# EAGLE design dbw.canbus.avr (EAGLE 5.07)
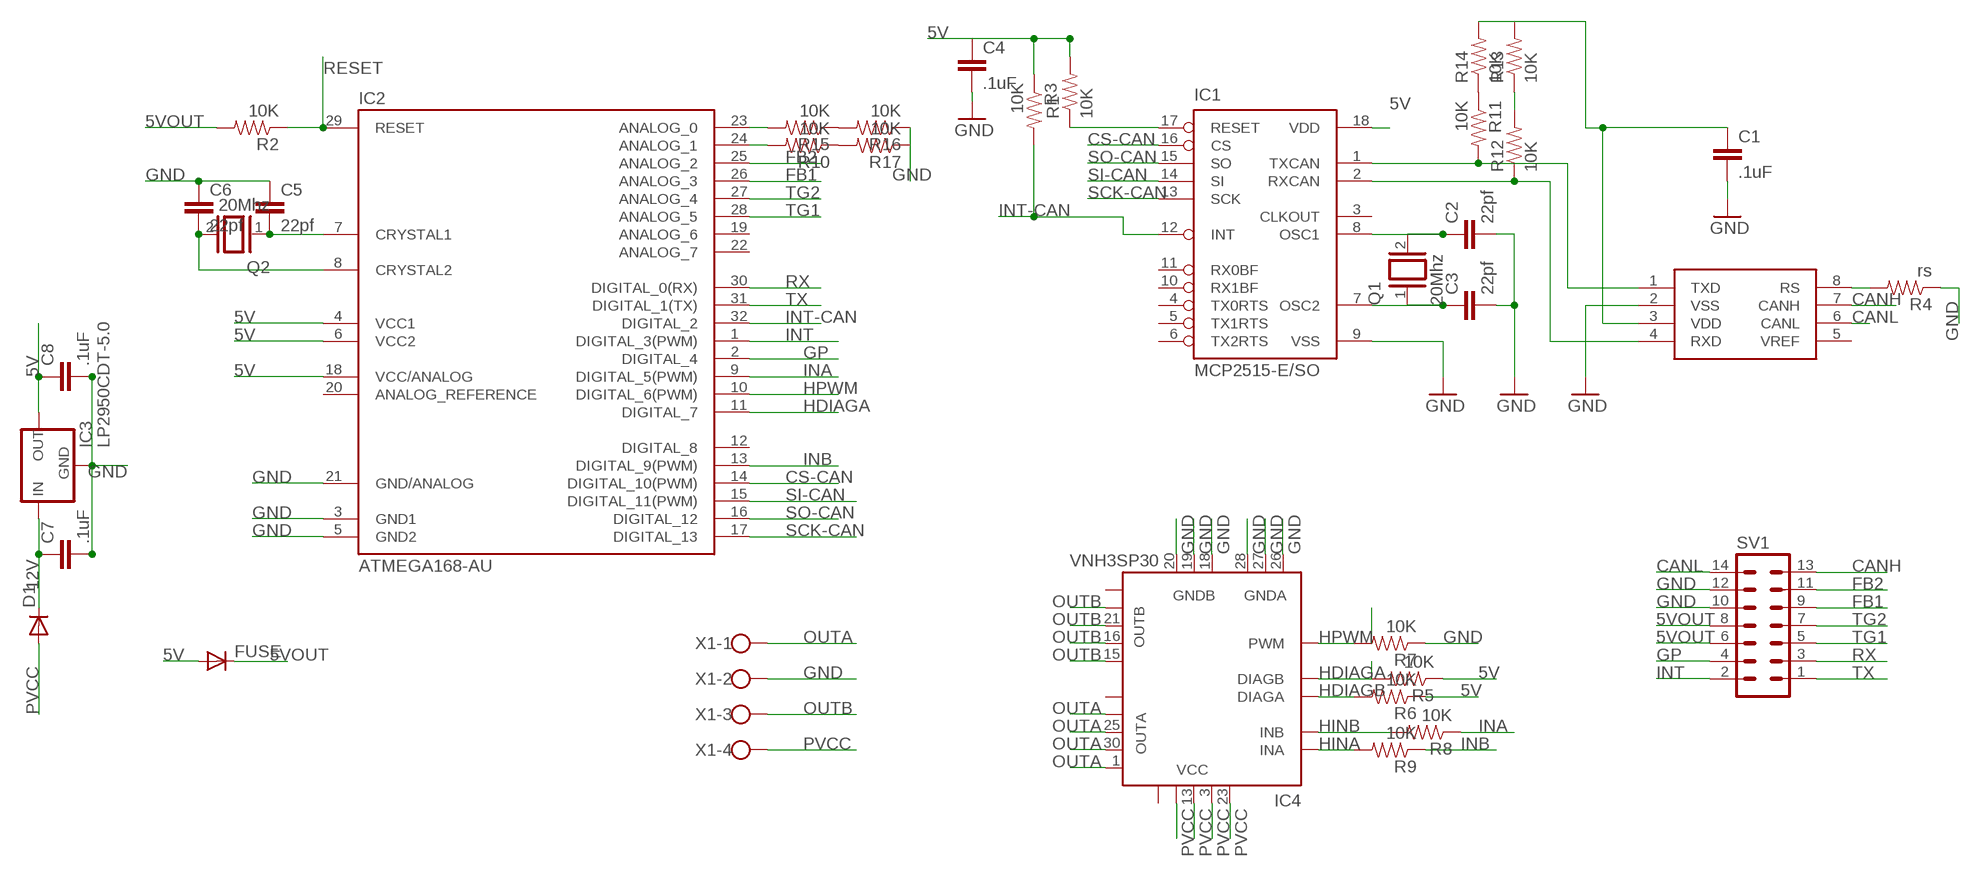
[diagram p0: schematic, sheet 1]

## Parts
C1  .1uF  CAP0805  [0805]
C2  22pf  CAP0805  [0805]
C3  22pf  CAP0805  [0805]
C4  .1uF  CAP1210  [1210]
C5  22pf  CAP0805  [0805]
C6  22pf  CAP0805  [0805]
C7  .1uF  CAP1210  [1210]
C8  .1uF  CAP1210  [1210]
D1  DIODE-DO-214AC  [DO-214AC]
FUSE  DIODE-DO-214AC  [DO-214AC]
IC1  MCP2515-E/SO  [SO18L]
IC2  ATMEGA168-AU  [TQFP32-08]
IC3  LP2950CDT-5.0  [DPACK]
IC4  VNH3SP30  [MULTIPOWERSO-30]
Q1  20Mhz  XTAL/S  [QS]
Q2  20Mhz  XTAL/S  [QS]
R1  10K  RESISTOR0805-RES  [0805]
R2  10K  RESISTOR0805-RES  [0805]
R3  10K  RESISTOR0805-RES  [0805]
R4  rs  RESISTOR0805-RES  [0805]
R5  10K  RESISTOR0805-RES  [0805]
R6  10K  RESISTOR0805-RES  [0805]
R7  10K  RESISTOR0805-RES  [0805]
R8  10K  RESISTOR0805-RES  [0805]
R9  10K  RESISTOR0805-RES  [0805]
R10  10K  RESISTOR0805-RES  [0805]
R11  10K  RESISTOR0805-RES  [0805]
R12  10K  RESISTOR0805-RES  [0805]
R13  10K  RESISTOR0805-RES  [0805]
R14  10K  RESISTOR0805-RES  [0805]
R15  10K  RESISTOR0805-RES  [0805]
R16  10K  RESISTOR0805-RES  [0805]
R17  10K  RESISTOR0805-RES  [0805]
SV1  ML14  [ML14]
U1  MCP2551  [SO08]
X1  W237-4  [W237-4]

## Nets
5V: C1.1 C4.1 C8.1 FUSE.A IC1.18(VDD) IC2.4(VCC1) IC2.6(VCC2) IC2.18(VCC/ANALOG) IC3.3(OUT) R1.2 R3.1 R5.1 R6.1 R13.2 R14.2 U1.3(VDD)
5VOUT: FUSE.C R2.2 SV1.6 SV1.8
12V: C7.1 D1.C IC3.1(IN)
CANH: SV1.13 U1.7(CANH)
CANL: SV1.14 U1.6(CANL)
CS-CAN: IC1.16(CS) IC2.14(DIGITAL_10(PWM))
FB1: IC2.26(ANALOG_3) SV1.9
FB2: IC2.25(ANALOG_2) SV1.11
GND: C1.2 C2.2 C3.2 C4.2 C5.1 C6.1 C7.2 C8.2 IC1.9(VSS) IC2.3(GND1) IC2.5(GND2) IC2.21(GND/ANALOG) IC3.4(GND) IC4.18(GNDB) IC4.19(GNDB) IC4.20(GNDB) IC4.26(GNDA) IC4.27(GNDA) IC4.28(GNDA) R4.1 R7.1 R16.1 R17.1 SV1.10 SV1.12 U1.2(VSS) X1.2
GP: IC2.2(DIGITAL_4) SV1.4
HDIAGA: IC2.11(DIGITAL_7) IC4.10(DIAGB) R5.2
HDIAGB: IC4.6(DIAGA) R6.2
HINA: IC4.5(INA) R9.2
HINB: IC4.11(INB) R8.2
HPWM: IC2.10(DIGITAL_6(PWM)) IC4.8(PWM) R7.2
INA: IC2.9(DIGITAL_5(PWM)) R8.1
INB: IC2.13(DIGITAL_9(PWM)) R9.1
INT: IC2.1(DIGITAL_3(PWM)) SV1.2
INT-CAN: IC1.12(INT) IC2.32(DIGITAL_2) R3.2
N$1: R4.2 U1.8(RS)
N$2: IC1.1(TXCAN) R11.2 U1.1(TXD)
N$3: IC1.2(RXCAN) R12.1 U1.4(RXD)
N$4: C2.1 IC1.8(OSC1) Q1.2
N$5: C3.1 IC1.7(OSC2) Q1.1
N$6: C5.2 IC2.7(CRYSTAL1) Q2.1
N$8: IC1.17(RESET) R1.1
N$9: C6.2 IC2.8(CRYSTAL2) Q2.2
N$10: IC2.24(ANALOG_1) R10.2
N$11: IC2.23(ANALOG_0) R15.2
N$13: R15.1 R16.2
N$14: R10.1 R17.2
N$15: R12.2 R13.1
N$17: R11.1 R14.1
OUTA: IC4.1(OUTA) IC4.25(OUTA) IC4.30(OUTA) IC4.OUTA X1.1
OUTB: IC4.15(OUTB) IC4.16(OUTB) IC4.21(OUTB) IC4.OUTB X1.3
PVCC: D1.A IC4.3(VCC) IC4.13(VCC) IC4.23(VCC) IC4.VCC X1.4
RESET: IC2.29(RESET) R2.1
RX: IC2.30(DIGITAL_0(RX)) SV1.3
SCK-CAN: IC1.13(SCK) IC2.17(DIGITAL_13)
SI-CAN: IC1.14(SI) IC2.15(DIGITAL_11(PWM))
SO-CAN: IC1.15(SO) IC2.16(DIGITAL_12)
TG1: IC2.28(ANALOG_5) SV1.5
TG2: IC2.27(ANALOG_4) SV1.7
TX: IC2.31(DIGITAL_1(TX)) SV1.1
Unconnected: IC1.3(CLKOUT) IC1.4(TX0RTS) IC1.5(TX1RTS) IC1.6(TX2RTS) IC1.10(RX1BF) IC1.11(RX0BF) IC2.12(DIGITAL_8) IC2.19(ANALOG_6) IC2.20(ANALOG_REFERENCE) IC2.22(ANALOG_7) IC4.OUTA@1(OUTA) IC4.OUTB@1(OUTB) U1.5(VREF)

## Power pins joined to a net without a drawn wire
5V: IC4.VCC@1(VCC)

## Library data of the parts
C1-C8 = SparkFun:CAP: Capacitor Standard 0603 ceramic capacitor, and 0.1" leaded capacitor.
D1 FUSE = diode:DIODE-: DIODE
IC1 = mcp2515:MCP2515
IC2 = Arduino-AVR:ATMEGA168
IC3 = v-reg:LP2950?*: Source: http://cache.national.com/ds/LP/LP2950.pdf
IC4 = st-microelectronics:VNH3SP30: FULLY INTEGRATED H-BRIDGE MOTOR DRIVER Source: http://pdf1.alldatasheet.com/datasheet-pdf/view/84563/STMICROELECTRONICS/VNH3SP30.html
Q1 Q2 = special:XTAL/S: CRYSTAL
R1-R17 = SparkFun:RESISTOR: Resistor Basic schematic elements and footprints for 0603, 1206, and PTH resistors.
SV1 = con-ml:ML14: HARTING
U1 = SparkFun:MCP2551
X1 = con-wago-500:W237-4: WAGO SCREW CLAMP

## Board
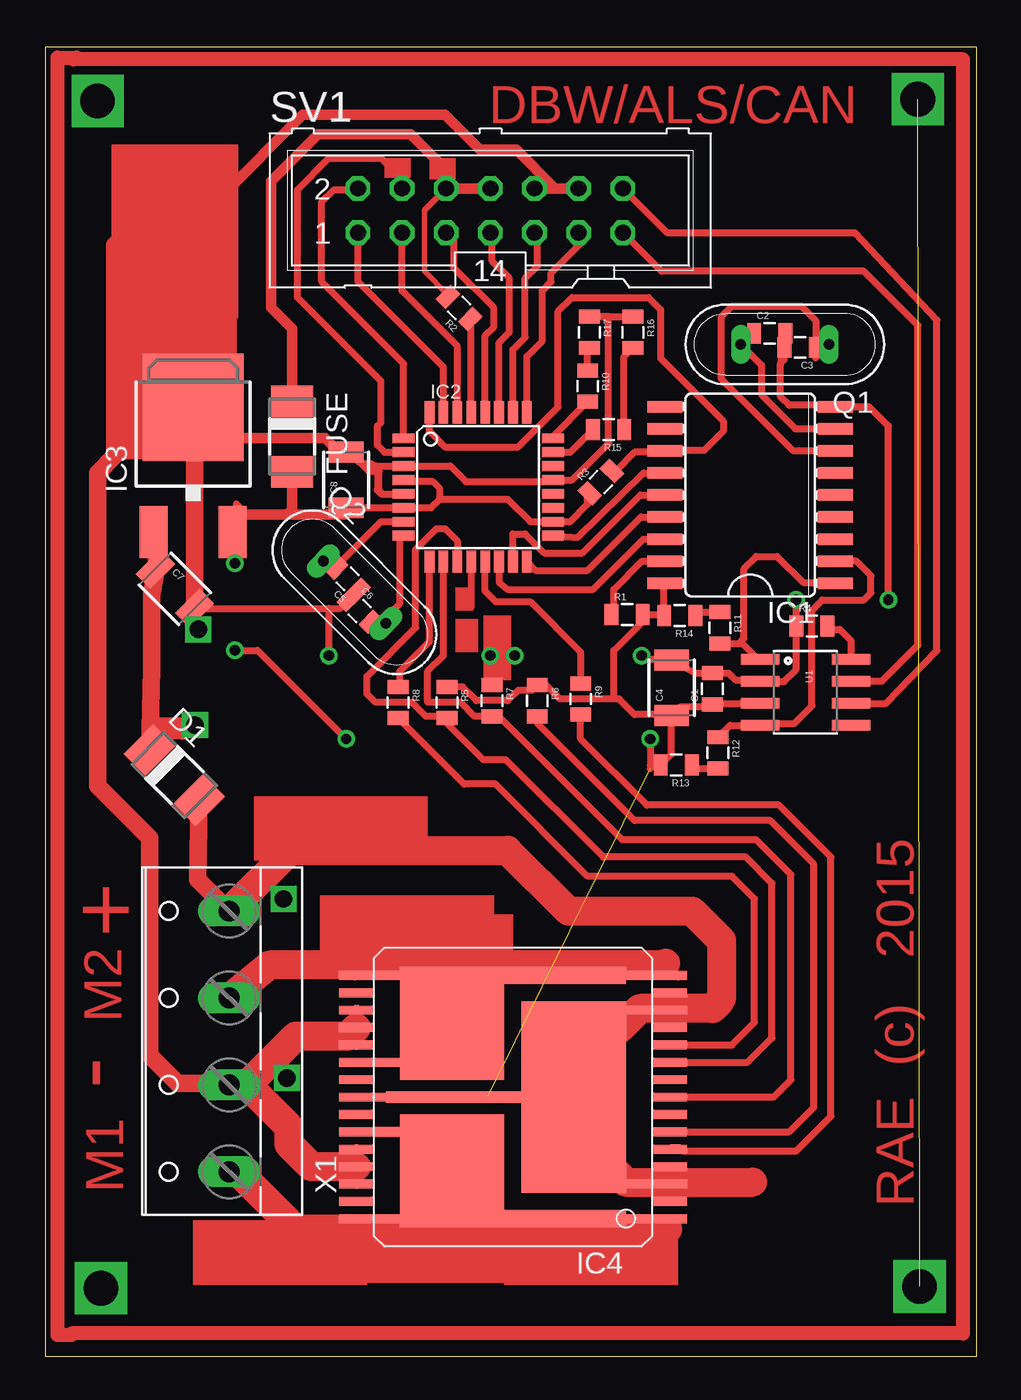
[diagram p1: board, top side]
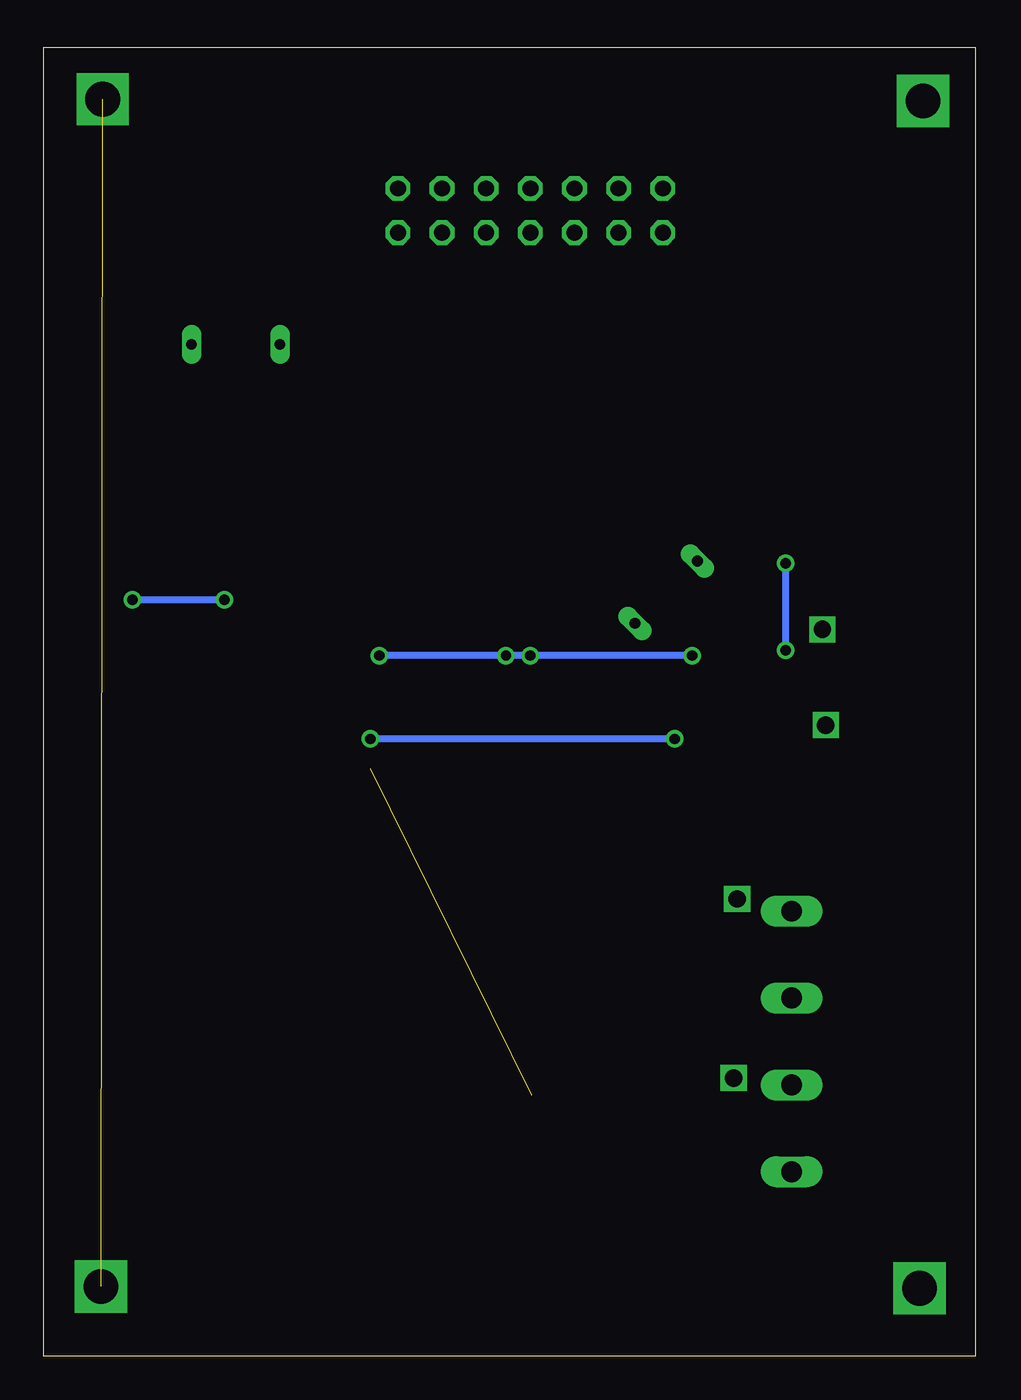
[diagram p2: board, bottom side, seen from below]

Size 53.6 x 75.3 mm. Coordinates in mm from the lower left corner, seen from the top.
Outline: 0,0 53.6,0 53.6,75.3 0,75.3 0,0
Copper layers (1*16): Top 0.035mm / dielectric 1.5mm / Bottom 0.035mm
Design rules "default": minimum track width 10mil, minimum drill 24mil, track to track 8mil, track to pad 8mil, pad to pad 8mil, via to via 8mil, smd to smd 8mil, copper to edge 40mil, drill to drill 8mil, minimum pad ring 10mil, minimum via ring 8mil, stop-mask expansion 4mil, vias tented up to drill 0mil, thermal gap 10mil

### Footprints (pad centres in the part's own frame; a part is rotated, then mirrored left to right if it is on the bottom)
0805 = smd 0.8 x 1.2: 1 -0.9,0; 2 0.9,0
1210 = smd 1.2 x 2: 1 -1.6,0; 2 1.6,0
DO-214AC = smd 1.8 x 2.4: A 2.025,0; C -2.025,0
SO18L = smd 0.66 x 2.032: 1 -5.08,-4.902; 2 -3.81,-4.902; 3 -2.54,-4.902; 4 -1.27,-4.902; 5 0,-4.902; 6 1.27,-4.902; 7 2.54,-4.902; 8 3.81,-4.902; 9 5.08,-4.902; 10 5.08,4.902; 11 3.81,4.902; 12 2.54,4.902; 13 1.27,4.902; 14 0,4.902; 15 -1.27,4.902; 16 -2.54,4.902; 17 -3.81,4.902; 18 -5.08,4.902
TQFP32-08 = smd 1.27 x 0.559: 1 -4.293,2.8; 2 -4.293,2; 3 -4.293,1.2; 4 -4.293,0.4; 5 -4.293,-0.4; 6 -4.293,-1.2; 7 -4.293,-2; 8 -4.293,-2.8; 17 4.293,-2.8; 18 4.293,-2; 19 4.293,-1.2; 20 4.293,-0.4; 21 4.293,0.4; 22 4.293,1.2; 23 4.293,2; 24 4.293,2.8 | smd 0.559 x 1.27: 9 -2.8,-4.293; 10 -2,-4.293; 11 -1.2,-4.293; 12 -0.4,-4.293; 13 0.4,-4.293; 14 1.2,-4.293; 15 2,-4.293; 16 2.8,-4.293; 25 2.8,4.293; 26 2,4.293; 27 1.2,4.293; 28 0.4,4.293; 29 -0.4,4.293; 30 -1.2,4.293; 31 -2,4.293; 32 -2.8,4.293
DPACK = smd 1.6 x 3: 1 -2.28,-4.8; 3 2.28,-4.8 | smd 5.8 x 6.2: 4 0,2.38
MULTIPOWERSO-30 = smd 0.508 x 12: 1 -7,-4; 15 7,-4; 16 7,4; 30 -7,4 | smd 0.508 x 2: 2 -6,-9; 4 -4,-9; 5 -3,-9; 6 -2,-9; 7 -1,-9; 8 0,-9; 9 1,-9; 10 2,-9; 11 3,-9; 12 4,-9; 14 6,-9; 17 6,9; 18 5,9; 19 4,9; 20 3,9; 22 1,9; 24 -1,9; 26 -3,9; 27 -4,9; 28 -5,9; 29 -6,9 | smd 0.508 x 4: 3 -5,-8; 13 5,-8; 21 2,8; 23 0,8; 25 -2,8 | smd 6.5 x 6: OUTA -4.25,3.5; OUTB 4.25,3.5 | smd 1 x 7.5: OUTA@1 -7,-2.755; OUTB@1 7,-2.755 | smd 11 x 6: VCC 0,-3.5 | smd 0.65 x 8.3: VCC@1 0,3.145
QS = drill 0.61 long: 1 -2.54,0; 2 2.54,0
ML14 = drill 0.914 octagon: 1 -7.62,-1.27; 2 -7.62,1.27; 3 -5.08,-1.27; 4 -5.08,1.27; 5 -2.54,-1.27; 6 -2.54,1.27; 7 0,-1.27; 8 0,1.27; 9 2.54,-1.27; 10 2.54,1.27; 11 5.08,-1.27; 12 5.08,1.27; 13 7.62,-1.27; 14 7.62,1.27
SO08 = smd 0.61 x 2.21: 1 -1.905,-2.616; 2 -0.635,-2.616; 3 0.635,-2.616; 4 1.905,-2.616; 5 1.905,2.616; 6 0.635,2.616; 7 -0.635,2.616; 8 -1.905,2.616
W237-4 = drill 1.194 long: 1 -7.5,-1.27; 2 -2.5,-1.27; 3 2.5,-1.27; 4 7.5,-1.27

### Placement (x,y rotation side)
C1  38.38,38.39 90 top
C2  41.68,58.83 0 top
C3  43.42,58.03 180 top
C4  36.03,38.45 90 top
C5  17.38,44.71 135 top
C6  18.08,42.87 315 top
C7  7.45,44.15 315 top
C8  17.3,50.4 90 top
D1  7.42,33.42 315 top
FUSE  14.2,52.9 270 top
IC1  40.55,49.54 90 top
IC2  24.9,50 0 top
IC3  8.5,52.2 0 top
IC4  26.9,14.9 90 top
Q1  42.55,58.2 180 top
Q2  17.78,43.94 315 top
R1  33.47,42.65 0 top
R2  23.8,60.3 135 top
R3  31.96,50.28 45 top
R4  44.1,42 0 top
R5  23.1,37.6 270 top
R6  28.3,37.7 270 top
R7  25.7,37.7 270 top
R8  20.3,37.6 270 top
R9  30.8,37.8 270 top
R10  31.2,55.8 270 top
R11  38.8,41.9 270 top
R12  38.7,34.7 270 top
R13  36.3,34 180 top
R14  36.5,42.6 180 top
R15  32.4,53.3 180 top
R16  33.8,58.9 270 top
R17  31.3,58.9 270 top
SV1  25.6,65.9 0 top
U1  43.73,38.19 270 top
X1  9.3,18.1 90 top

### Tracks (layer width: path | path; a pad name or v marks a point on that pad's centre or on a via)
5V  (via drill 0.6)  (1 unrouted)
  Top 0.406: U1.3 38.45,37.56 C1.1 38.25,37.36 36.54,37.36 C4.1 | 22.7,49.3 22.2,48.8 IC2.6 C8.1 17.2,48.4 | 22.7,49.3 22.7,49.9 22.3,50.3 20.71,50.3 IC2.4 | 22.7,49.3 26.6,49.3 27.9,48 IC2.18 30.2,48 31.2,49 31.2,49.52 R3.1 | IC4.VCC@1 25.4,14.9 25.5,15 23.8,15 23.6,14.8 | IC3.3 10.98,49.02 11.2,48.8 | 11.2,48.8 11.6,48.4 | IC1.18 35.6,44.41 R14.2 35.55,42.65 R1.2 34.37,42.27 32.7,40.6 32.7,37.9 32.6,37.8 | C4.1 36.03,34.63 R13.2 34.8,34 | R5.1 24,38.5 24.8,37.7 26.6,37.7 27.2,38.3 28,38.3 R6.1 28.8,38.6 29.6,37.8 32.6,37.8 | 32.6,37.8 33,37.8 33.9,36.9 35.98,36.9 C4.1 | v34.8,35.5 34.8,34 | 34.8,34 34.8,33.8 | v10.9,45.6 10.9,48.5 11.2,48.8 | 17.2,35.6 v17.3,35.5 12.2,40.6 v10.9,40.6
  Top 0.61: 11.6,48.4 13.9,48.4 | 13.9,48.4 17.2,48.4 | FUSE.A 14.2,48.7 13.9,48.4
  Bottom 0.406: v17.3,35.5 v34.8,35.5 | v10.9,40.6 v10.9,45.6
5VOUT
  Top 0.305: R2.2 23.16,61.04 21.8,62.4 21.8,65.91 SV1.6
  Top 0.61: FUSE.C 14.2,59.1 13,60.3 13,67.6 15.7,70.3 21,70.3 23,68.3 23,67.23 SV1.6 SV1.8
12V
  Top 1.016: IC3.1 6.42,45.38 C7.1 6.32,44.92 6.1,43.8 6.1,39.54 D1.C
CANH
  Top 0.406: U1.7 48.12,38.83 50.2,40.9 50.2,59.3 47.1,62.4 35.45,62.4 SV1.13
CANL
  Top 0.406: U1.6 48.36,37.56 51.3,40.6 51.3,59.6 46.6,64.6 35.79,64.6 SV1.14
CS-CAN
  Top 0.406: IC1.16 34.4,47 31.5,44.1 26.6,44.1 26.1,44.5 IC2.14
FB1
  Top 0.406: IC2.26 26.9,57.9 27.6,58.6 27.6,62 28.3,62.7 28.3,64.47 SV1.9
FB2
  Top 0.406: IC2.25 27.7,57.5 28.6,58.4 28.6,61.3 29.1,61.8 29.1,62.3 30.8,64 30.8,64.51 SV1.11
GND  (via drill 0.6)
  Top 0.406: C2.2 42.48,57.27 C3.2 42.3,57.01 42.3,55.2 42.8,54.7 44.9,54.7 44.98,54.62 IC1.9 | IC1.9 45.37,54.7 | C6.1 C5.1 16.96,43.02 16.3,43.02 | 19,51.2 18.4,51.2 C8.2 | 19,51.2 IC2.3 23.3,51.2 24.2,50.3 29.09,50.3 IC2.21 30.3,50.4 32.4,52.5 32.4,59.8 R17.1 R16.1 | 19.4,49.6 IC2.5 | 19.4,49.6 19.1,49.9 19.1,51.1 19,51.2 | C7.2 16.3,43.02 | 19.4,49.6 19.3,49.6 19.2,49.7 | 19.2,49.7 19.2,50.9 18.8,51.3 18.3,51.3 17.5,52.1 | 10.9,57.1 10.6,56.8 10.6,55.6 10.2,55.2 | R7.1 25.8,38.6 25.8,40.3 v25.6,40.3 | 16.3,40.4 v16.3,40.3 16.3,43.02 | v34.3,40.3 34.3,40.1 35.9,40.1 C4.2 37.39,39.29 C1.2 39.31,39.29 39.7,38.9 41.04,38.9 U1.2 41.3,38.8 42.5,38.8 43.2,39.5 R4.1 v43.2,43.5 | v48.5,43.5 48.5,53.5 47.4,54.6 45.47,54.6 IC1.9 | 17.5,52 17,52 | 17.5,52 17.9,52 18.1,52.2 | 19.2,49.7 19.1,49.8 19.1,50.8 19,50.9 18.6,50.9 17.5,52 | IC4.18 17.9,19.1 16.9,18.1 14.7,18.1 14.6,18.2 14.2,18.2 11.7,15.7
  Top 0.61: 17,52 C8.2 | 9.8,55.2 10.2,55.2 | 9.8,55.2 9.7,55.3 8.88,55.3 8.58,55.6 | 17.5,52 16.9,52 16.1,52.8 11,52.8 10.1,53.7 10.1,54.9 9.8,55.2 | SV1.10 SV1.12 29.33,67.17 27.1,69.4 25,69.4 23,71.4 14.8,71.4 10.1,66.7 10.1,65.9 10.1,56.9 9.3,56.1 9.3,55.38 IC3.4 | IC4.28 IC4.27 IC4.26 | IC4.20 IC4.19 IC4.18
  Top 1.016: C7.2 8.58,55.6 8.58,56.47 IC3.4 | 11.7,15.7 7.6,15.7 6,17.3 6,29.8 3,32.8 3,50.8 4,51.8 | 4,51.8 4.2,52 | 4,51.8 4,63.9 5.9,65.8 10,65.8 10.1,65.9
  Top 1.676: 11.6,15.6 X1.2 | 11.6,15.6 11.7,15.7 14.4,18.4 17.4,18.4 IC4.19 | IC4.27 15.3,10.9 14,12.2 14,13.2 11.6,15.6
  Bottom 0.406: v16.3,40.3 v25.6,40.3 v27,40.3 v34.3,40.3 | v43.2,43.5 v48.5,43.5
GP
  Top 0.406: SV1.4 20.52,67.68 19.3,68.9 16.3,68.9 14.5,67.1 14.5,60.9 19.3,56.1 19.3,53.7 19.1,53.5 19.1,52.4 19.5,52 IC2.2
HDIAGA
  Top 0.406: IC2.11 23.7,46.9 23,47.6 22.5,47.6 21.3,46.4 21.3,41.9 18.5,39.1 18.5,38.1 19,37.6 21.1,37.6 21.9,36.8 23,36.8 R5.2 23.1,36.4 25.2,34.3 26.5,34.3 32.1,28.7 40.3,28.7 41.8,27.2 41.8,18.3 40.4,16.9 IC4.10
HDIAGB
  Top 0.406: R6.2 28.3,36.4 33.9,30.8 41.7,30.8 44.2,28.3 44.2,14.3 42.8,12.9 IC4.6
HINA
  Top 0.406: R9.2 30.8,35.5 34.6,31.7 42.2,31.7 45.2,28.7 45.2,13.8 43.2,11.8 36.7,11.8 36.5,12 36,12 IC4.5
HINB
  Top 0.406: IC4.11 39.5,17.9 40.8,19.2 40.8,26.3 39.5,27.6 31.2,27.6 25.9,32.9 24.1,32.9 R8.2
HPWM
  Top 0.406: IC2.10 22.9,40.3 22,39.4 22,37.6 23.9,37.6 24.7,36.8 R7.2 26.1,36.8 33.2,29.7 40.9,29.7 42.9,27.7 42.9,15.9 41.9,14.9 IC4.8
INA
  Top 0.406: IC2.9 22.1,41.1 20.4,39.4 20.4,38.6 R8.1
INB
  Top 0.406: R9.1 30.8,40.5 27.9,43.4 25.9,43.4 25.3,44 IC2.13
INT
  Top 0.406: IC2.1 20.61,57.09 15.9,61.8 15.9,66.4 16.6,67.1 17.91,67.1 SV1.2
INT-CAN
  Top 0.406: IC1.12 35.55,51.98 | IC2.32 22.1,53.2 23,52.3 27.2,52.3 29.5,54.6 29.5,60.1 30.3,60.9 34.7,60.9 35.4,60.2 35.4,57.4 39,53.8 39,53.2 37.9,52.1 35.67,52.1 IC1.12 | R3.2 32.82,50.92 33.9,52 35.57,52 IC1.12
N$1
  Top 0.406: U1.8 46.35,41.15 45.7,41.8 45.2,41.8 R4.2
N$2
  Top 0.406: U1.1 41.01,40.09 40.1,41 39.9,41 | R11.2 39.9,41 | IC1.1 45.4,44.5 43.6,44.5 42.1,46 40.9,46 40.2,45.3 40.2,41.3 39.9,41
N$3
  Top 0.406: 45.38,45.8 IC1.2 46.67,45.73 47.5,44.9 47.5,43.9 47.1,43.5 44.7,43.5 44.1,42.9 44.1,37.4 43.1,36.4 41.23,36.4 U1.4 39.38,36.29 R12.1
N$4
  Top 0.406: C2.1 40.68,58.87 Q1.2 41.2,57.01 41.2,55.3 43.15,53.35 IC1.8
N$5
  Top 0.406: Q1.1 44.32,57.43 C3.1 44.32,59.58 43.5,60.4 39.5,60.4 38.9,59.8 38.9,56.2 43,52.1 45.43,52.1 IC1.7
N$6
  Top 0.406: Q2.1 17.03,45.74 C5.2 17.15,45.85 19.3,48 IC2.7
N$7
  Top 0.813: 1.6,74.6 52.8,74.6 52.8,1.3 1.5,1.3 1.5,1.2 0.7,1.2 0.7,74.7 1.8,74.7
N$8
  Top 0.406: IC1.17 34.33,45.73 32.7,44.1 32.7,42.79 R1.1
N$9
  Top 0.406: C6.2 19.47,42.03 Q2.2 19.58,42.48 20.4,43.3 20.4,46.99 IC2.8
N$10
  Top 0.406: IC2.24 29.19,52.89 R10.2
N$11
  Top 0.406: IC2.23 30.2,52 R15.2
N$13
  Top 0.406: R15.1 33.3,57.5 R16.2
N$14
  Top 0.406: R10.1 31.2,57.9 R17.2
N$15
  Top 0.406: R12.2 37.4,33.8 R13.1
N$16
  Top 0.406: 24.5,45.6 24.5,43.1
N$17
  Top 0.406: R11.1 37.6,42.8 R14.1
N$18  (via drill 1)
  other vias: 13.7,26.3
N$19  (via drill 1)
  other vias: 13.9,16
N$20  (via drill 2)
  other vias: 3,72.2
N$21  (via drill 1)
  other vias: 8.8,41.8
N$22  (via drill 2)
  other vias: 3.2,3.9
N$23  (via drill 2)  (1 unrouted)
  other vias: 50.3,4 50.2,72.3
N$24  (via drill 1)
  other vias: 8.6,36.3
N$26
  Top 1.27: 7.9,36.1 6.3,36.1
OUTA
  Top 0.406: IC4.1 IC4.30 22.9,10.15 IC4.OUTA 23.4,12.7 23.2,12.9 IC4.25
  Top 0.61: IC4.25 21.4,12.9 22.4,11.9 22.4,8.5 21.3,7.4 14.6,7.4 14.2,7.8 13.6,7.8 10.8,10.6 | X1.1 10.3,10.6
  Top 0.813: 31.1,7.4 31.1,7.7 IC4.1
  Top 1.676: X1.1 10.8,10.6 11.1,10.6 14.4,7.3 31.2,7.3 | 31.2,7.3 35.8,7.3 | 31.1,7.4 31.2,7.3
OUTB
  Top 0.406: IC4.21 23.4,16.9 | 23.4,16.9 23.5,16.8 23.5,21.9 IC4.15 35.7,21.9 | 23.3,21.8 36.4,21.8 36.3,21.9 35.7,21.9 | 23.3,21.8 17.8,21.8 | 23.4,16.9 IC4.OUTB | IC4.16 23.2,21.9 23.3,21.8 | 35.7,21.9 35.7,22.6
  Top 1.676: X1.3 12.9,22.5 35.6,22.5 35.7,22.6
PVCC
  Top 0.406: IC4.3 32.1,9.9 30.75,11.25 | IC4.13 30.5,19.9 30.4,19.8 30.9,19.3 31.4,19.3 | IC4.13 35.8,19.9 35.8,20 35,20 IC4.13 | IC4.VCC IC4.23
  Top 1.016: D1.A 8.75,27.42 X1.4
  Top 1.676: 31.6,17.5 32.9,18.8 33,18.8 34.2,20 38.4,20 38.8,20.4 38.8,20.5 38.9,20.6 38.9,23.9 37.2,25.6 30.1,25.6 26.6,29.1 14.07,29.1 X1.4 | 31.6,17.5 31.6,19.1 31.4,19.3 | 31.6,17.5 31.6,16.1 IC4.VCC | IC4.VCC 30.4,11.6 30.75,11.25 | IC4.VCC 30.4,13 33.4,10 40.7,10
RESET
  Top 0.406: IC2.29 24.5,59.6 R2.1
RX
  Top 0.406: SV1.3 20.52,61.28 23.7,58.1 IC2.30
SCK-CAN
  Top 0.406: IC1.13 34.41,50.81 30.6,47.1 IC2.17
SI-CAN
  Top 0.406: IC1.14 34.24,49.54 30.9,46.2 28.7,46.2 27.6,47.3 26.9,47.3 IC2.15
SO-CAN
  Top 0.406: IC1.15 34.27,48.27 31.2,45.2 28.21,45.2 IC2.16
TG1
  Top 0.406: IC2.28 25.3,58.7 25.8,59.2 25.8,60.3 23.5,62.6 23.5,64.19 SV1.5
TG2
  Top 0.406: IC2.27 26.1,58.3 26.7,58.9 26.7,62 25.7,63 25.7,64.53 SV1.7
TX
  Top 0.406: SV1.1 17.98,61.82 22.9,56.9 IC2.31
(copper drawn outside any net)
  shapes: Top area x20

### Text on the board
Top: DBW/ALS/CAN | RAE (c) 2015 | + | M2 | - | M1